# EAGLE schematic RFMultiOut (EAGLE 7.3.0)
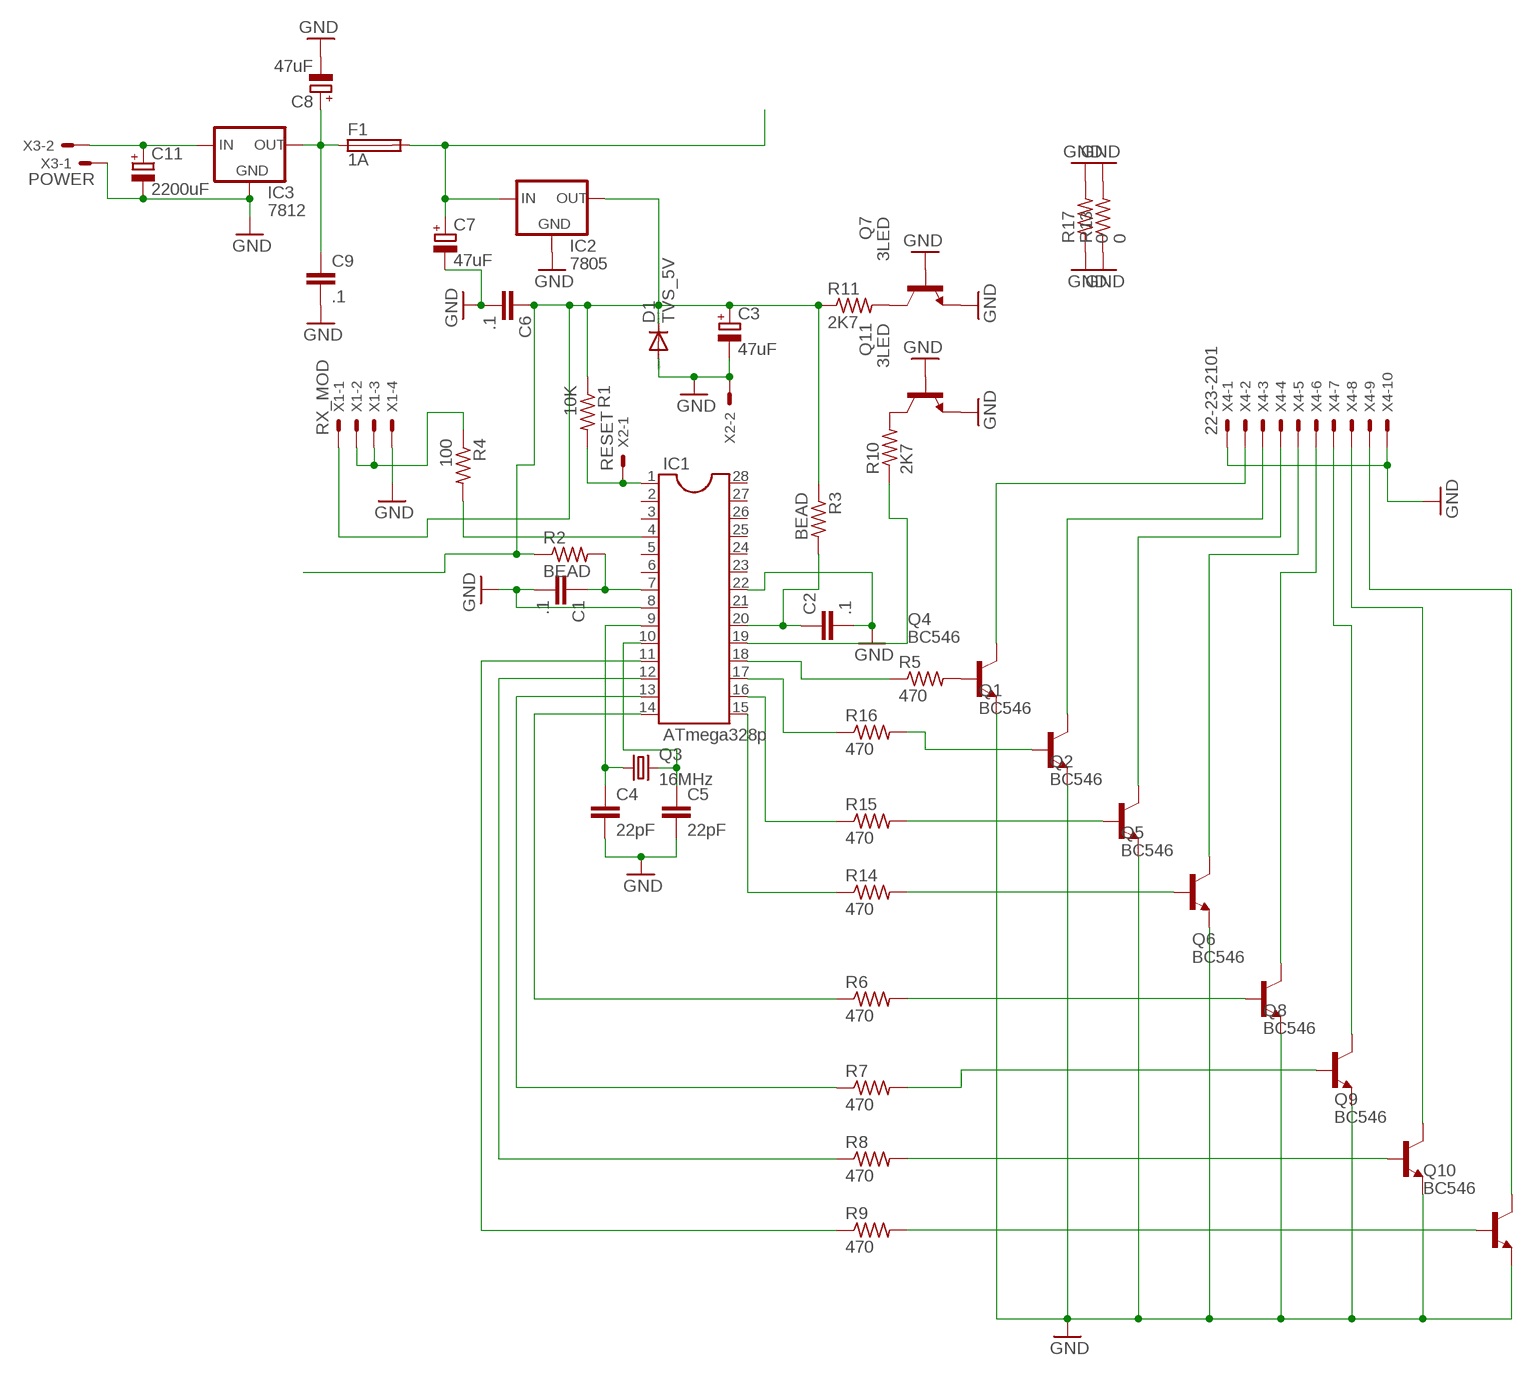
[diagram p0: schematic, sheet 1]

## Parts
C1  .1  C-EUC1210K  [C1210K]
C2  .1  C-EUC1210K  [C1210K]
C3  47uF  CPOL-EUE5-8.5  [E5-8,5]
C4  22pF  C-EUC1210K  [C1210K]
C5  22pF  C-EUC1210K  [C1210K]
C6  .1  C-EUC1210K  [C1210K]
C7  47uF  CPOL-EUE5-8.5  [E5-8,5]
C8  47uF  CPOL-EUE5-8.5  [E5-8,5]
C9  .1  C-EUC1210K  [C1210K]
C11  2200uF  CPOL-EUE5-8.5  [E5-8,5]
D1  TVS_5V  1N4148DO35-10  [DO35-10]
F1  1A  19560  [19560]
IC1  ATmega328p  DIL28-3  [DIL28-3]
IC2  7805  78XXS  [78XXS]
IC3  7812  78XXS  [78XXS]
Q1  BC546  BC546B  [TO92-EBC]
Q2  BC546  BC546B  [TO92-EBC]
Q3  16MHz  CRYSTALHC49S  [HC49/S]
Q4  BC546  BC546B  [TO92-EBC]
Q5  BC546  BC546B  [TO92-EBC]
Q6  BC546  BC546B  [TO92-EBC]
Q7  3LED  BC546A  [TO92-EBC]
Q8  BC546  BC546B  [TO92-EBC]
Q9  BC546  BC546B  [TO92-EBC]
Q10  BC546  BC546B  [TO92-EBC]
Q11  3LED  BC546A  [TO92-EBC]
R1  10K  R-US_0309/10  [0309/10]
R2  BEAD  R-US_0309/10  [0309/10]
R3  BEAD  R-US_0309/12  [0309/12]
R4  100  R-US_0207/15  [0207/15]
R5  470  R-US_R1210  [R1210]
R6  470  R-US_R1210  [R1210]
R7  470  R-US_R1210  [R1210]
R8  470  R-US_R1210  [R1210]
R9  470  R-US_R1210  [R1210]
R10  2K7  R-US_0309/10  [0309/10]
R11  2K7  R-US_0309/10  [0309/10]
R13  0  R-US_0309/10  [0309/10]
R14  470  R-US_R1210  [R1210]
R15  470  R-US_R1210  [R1210]
R16  470  R-US_R1210  [R1210]
R17  0  R-US_0309/10  [0309/10]
X1  RX_MOD  22-23-2041  [22-23-2041]
X2  RESET  22-23-2021  [22-23-2021]
X3  POWER  22-23-2021  [22-23-2021]
X4  22-23-2101  [22-23-2101]

## Nets
GND: C1.2 C2.2 C3.- C4.2 C5.2 C6.2 C7.- C8.- C9.2 C11.- D1.A IC1.8 IC1.22 IC2.GND IC3.GND Q1.E Q2.E Q4.E Q5.E Q6.E Q7.B Q7.E Q8.E Q9.E Q10.E Q11.B Q11.E R13.1 R13.2 R17.1 R17.2 X1.4 X2.2 X3.1 X4.1 X4.10
N$1: IC1.14 R6.1
N$2: IC1.1 R1.2 X2.1
N$3: IC1.4 R4.2
N$4: C2.1 IC1.20 R3.2
N$5: R4.1 X1.2 X1.3
N$7: IC1.13 R7.1
N$8: IC1.12 R8.1
N$9: C3.+ C6.1 D1.C IC2.OUT R1.1 R2.1 R3.1 R11.1 X1.1
N$10: IC1.11 R9.1
N$11: IC1.18 R5.1
N$12: Q4.B R5.2
N$13: C4.1 IC1.9 Q3.1
N$14: C5.1 IC1.10 Q3.2
N$15: C7.+ F1.2 IC2.IN
N$16: Q1.C X4.3
N$17: Q10.B R9.2
N$18: IC1.15 R14.1
N$19: IC1.16 R15.1
N$20: IC1.17 R16.1
N$21: Q9.B R8.2
N$22: Q7.C R11.2
N$24: Q8.B R7.2
N$25: C8.+ C9.1 F1.1 IC3.OUT
N$26: Q6.B R6.2
N$27: Q5.B R14.2
N$28: Q2.B R15.2
N$29: Q1.B R16.2
N$30: Q4.C X4.2
N$31: C11.+ IC3.IN X3.2
N$32: Q2.C X4.4
N$33: Q5.C X4.5
N$34: Q6.C X4.6
N$35: C1.1 IC1.7 R2.2
N$36: Q8.C X4.7
N$37: Q9.C X4.8
N$38: Q10.C X4.9
N$40: Q11.C R10.2
N$41: IC1.19 R10.1
Unconnected: IC1.2 IC1.3 IC1.5 IC1.6 IC1.21 IC1.23 IC1.24 IC1.25 IC1.26 IC1.27 IC1.28

## Library data of the parts
C1 C2 C4-C6 C9 = resistor:C-EU: CAPACITOR, European symbol
C3 C7 C8 C11 = resistor:CPOL-EU: POLARIZED CAPACITOR, European symbol
D1 = diode:1N4148: DIODE high speed (Philips)
F1 = fuse:19560: FUSE HOLDER TR5, Wickmann; MPN: 56000001009; OC_FARNELL: 1185363; OC_NEWARK: 15P8392
IC1 = ic-package:DIL28: Dual In Line
IC2 IC3 = v-reg:78XXS: VOLTAGE REGULATOR
Q1 Q2 Q4-Q11 = transistor-npn:BC546*: NPN Transistor
Q3 = crystal:CRYSTAL: CRYSTAL; OC_FARNELL: 1667008; OC_NEWARK: unknown
R1-R11 R13-R17 = resistor:R-US_: RESISTOR, American symbol
X1 = con-molex:22-23-2041: .100" (2.54mm) Center Header - 4 Pin; MF: MOLEX; MPN: 22-23-2041; OC_FARNELL: 1462920; OC_NEWARK: 38C0355
X2 X3 = con-molex:22-23-2021: .100" (2.54mm) Center Header - 2 Pin; MF: MOLEX; MPN: 22-23-2021; OC_FARNELL: 1462926; OC_NEWARK: 25C3832
X4 = con-molex:22-23-2101: .100" (2.54mm) Center Header - 10 Pin; MF: MOLEX; MPN: 22-23-2101; OC_FARNELL: 1756828; OC_NEWARK: 94C0765